# EAGLE design nano (EAGLE 7.2.0)
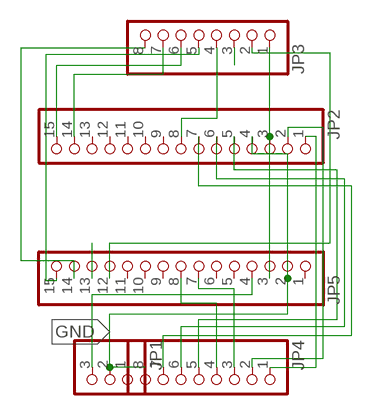
[diagram p0: schematic, sheet 1]

## Parts
JP1  PINHD-1X3CB  [1X03-CLEANBIG]
JP2  PINHD-1X15  [1X15]
JP3  PINHD-1X8CLEANBIG  [1X08-CLEANBIG]
JP4  PINHD-1X8CLEANBIG  [1X08-CLEANBIG]
JP5  PINHD-1X15  [1X15]

## Nets
GND: JP1.2 JP2.4 JP4.8 JP5.2
N$1: JP1.3 JP5.4
N$4: JP4.3 JP5.7
N$6: JP4.4 JP5.8
N$7: JP2.1 JP4.1
N$8: JP2.2 JP4.2
N$9: JP3.5 JP5.15
N$10: JP2.15 JP3.6
N$11: JP2.14 JP3.7
N$12: JP2.5 JP4.5
N$13: JP2.3 JP3.1 JP5.3
N$14: JP3.2 JP5.12
N$15: JP3.3
N$16: JP3.8 JP5.14
N$17: JP5.13
N$18: JP2.6 JP4.6
N$19: JP2.7 JP4.7
N$20: JP2.8 JP3.4
Unconnected: JP1.1 JP2.9 JP2.10 JP2.11 JP2.12 JP2.13 JP5.1 JP5.5 JP5.6 JP5.9 JP5.10 JP5.11

## Library data of the parts
JP1 = adafruit:PINHD-1X3: PIN HEADER
JP2 JP5 = pinhead:PINHD-1X15: PIN HEADER
JP3 JP4 = adafruit:PINHD-1X8: PIN HEADER

## Board
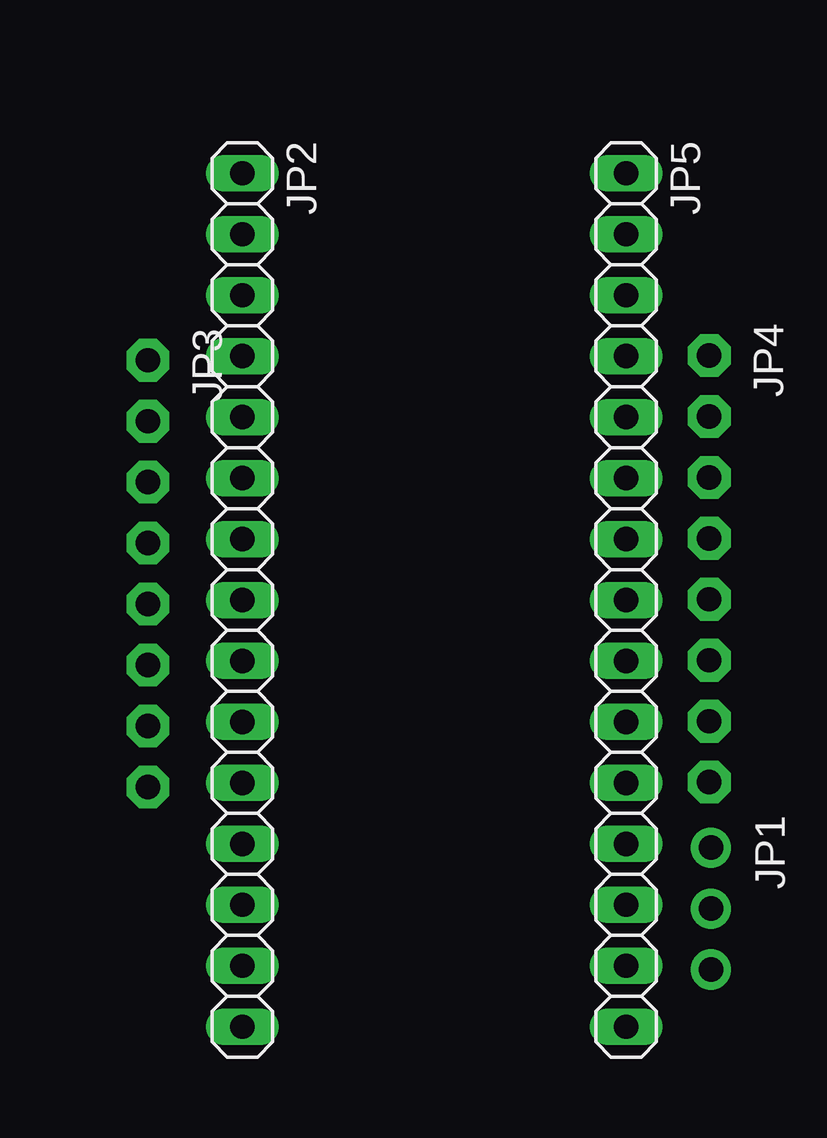
[diagram p1: board, top side]
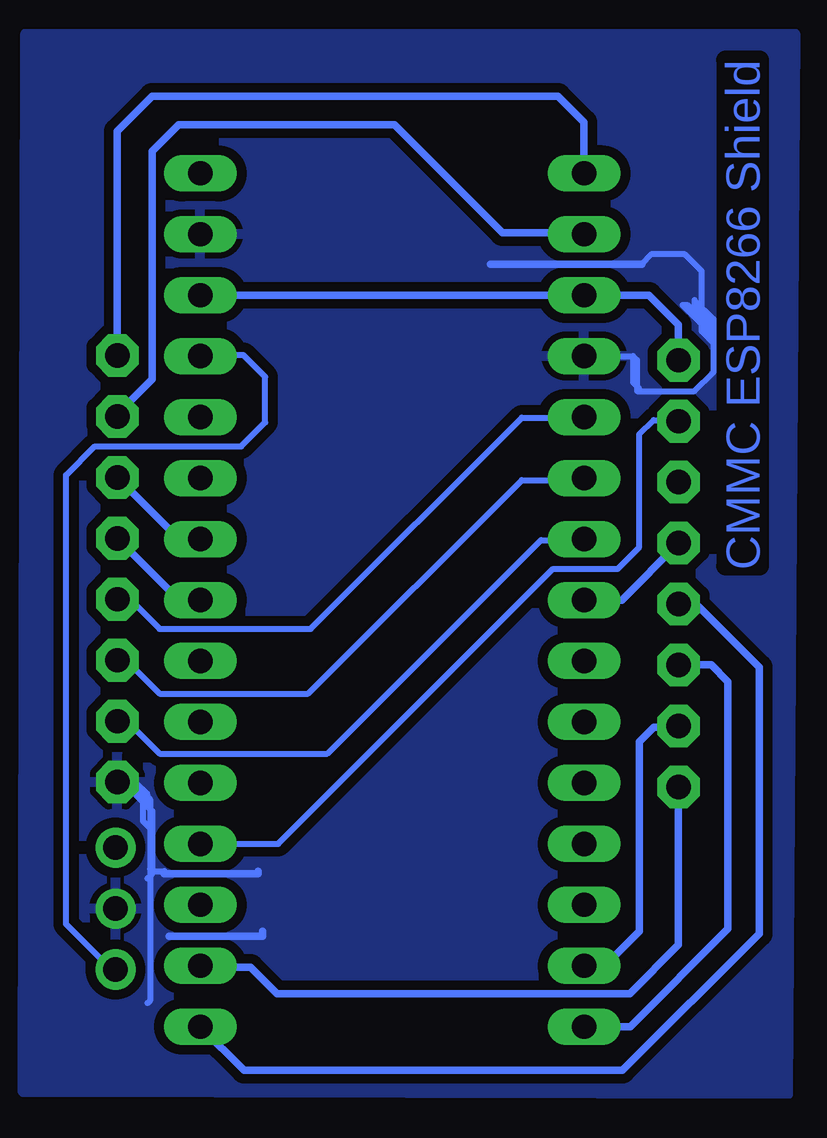
[diagram p2: board, bottom side, seen from below]

No outline drawn. Coordinates in mm, seen from the top.
Copper layers (1*16): Top 0.035mm / dielectric 1.5mm / Bottom 0.035mm
Design rules "default": minimum track width 10mil, minimum drill 24mil, track to track 8mil, track to pad 8mil, pad to pad 8mil, via to via 8mil, smd to smd 8mil, copper to edge 40mil, drill to drill 8mil, minimum pad ring 10mil, minimum via ring 8mil, stop-mask expansion 4mil, vias tented up to drill 0mil, thermal gap 10mil

### Footprints (pad centres in the part's own frame; a part is rotated, then mirrored left to right if it is on the bottom)
1X03-CLEANBIG = drill 1.016 pad 1.676: 1 -2.54,0; 2 0,0; 3 2.54,0
1X15 = drill 1.016 long: 1 -17.78,0; 2 -15.24,0; 3 -12.7,0; 4 -10.16,0; 5 -7.62,0; 6 -5.08,0; 7 -2.54,0; 8 0,0; 9 2.54,0; 10 5.08,0; 11 7.62,0; 12 10.16,0; 13 12.7,0; 14 15.24,0; 15 17.78,0
1X08-CLEANBIG = drill 1.016 pad 1.778 octagon: 1 -8.89,0; 2 -6.35,0; 3 -3.81,0; 4 -1.27,0; 5 1.27,0; 6 3.81,0; 7 6.35,0; 8 8.89,0

### Placement (x,y rotation side)
JP1  28.04,7.74 270 top
JP2  8.5,20.6 270 top
JP3  4.57,21.7 270 top
JP4  27.96,21.9 270 top
JP5  24.5,20.6 270 top

### Tracks (layer width: path | path; a pad name or v marks a point on that pad's centre or on a via)
GND
  Bottom 0.254: 27.71,13.01 26.5,11.8 26.5,9.3 | JP4.8 27.71,13.01 | 26.5,9.3 26.5,9.2 26.6,9.1 | 26.6,9.1 26.7,9 | 27.71,13.01 27.21,13.01 | 27.21,13.01 26.7,12.5 26.9,12.5 | 26.9,12.5 27.1,12.5 27.2,12.6 27.2,12.7 27.3,12.8 | JP2.4 6.46,30.76 | 6.46,30.76 6.3,30.6 6.3,29.3 6.2,29.3 | 27.21,12.91 27.21,12.81 | 27.21,12.81 26.9,12.5 | 26.9,12.5 26.9,11.4 26.6,11.1 26.6,9.1 | 27.21,13.01 27.21,12.91 | 27.21,12.91 26.6,12.3 26.6,12 | 26.6,12 26.6,9.4 | 26.6,9.4 26.5,9.3 | 26.5,9.3 26,9.3 25.9,9.2 22.2,9.2 22.1,9.3 | 27.21,12.81 27.21,12.61 26.6,12 | 26.6,9.4 26.6,3.9 26.7,3.8 | 6.46,30.76 6.46,29.66 6.2,29.4 6.2,29.3 | 6.2,29.3 3.9,29.3 3.1,30.1 3.1,31.3 | 3.1,31.3 3.6,31.8 3.6,32.3 | 3.6,32.3 3.6,34.3 4.3,35 5.7,35 6.1,34.6 | 3.1,31.3 3.1,32.3 3.9,33.1 3.9,32.8 3.2,32.1 3.2,31.8 | 3.2,31.7 3.2,31.8 | 3.2,31.8 3.4,32 | 3.3,31.7 3.5,31.9 3.5,32 | 3.5,32 3.5,32.1 3.4,32.2 | 3.5,32 4.4,32.9 4.2,32.9 3.6,32.3
  Bottom 0.305: 12.4,34.6 6.1,34.6 | 26,9.2 25.9,9.2 22.1,9.2 22.1,9.3 | 25.8,6.6 21.9,6.6 21.9,6.8
  pour Bottom (isolate 0.4): 0,0 31.9,0.1 31.8,44.2 -0.3,44.2
N$1
  Bottom 0.254: JP1.3 28.2,5.2 30.1,7.1 30.1,25.8 28.9,27 22.8,27 21.8,28 21.8,29.9 22.7,30.8 24.46,30.8 JP5.4
N$4
  Bottom 0.305: JP5.7 25.39,23.14 JP4.3
N$6
  Bottom 0.305: JP5.8 25.39,20.6 JP4.4
N$7
  Bottom 0.305: JP4.1 27.96,40.13 26.5,41.6 9.6,41.6 8.5,40.5 JP2.1
N$8
  Bottom 0.305: JP4.2 27.96,28.34 26.5,29.8 26.5,39.3 25.4,40.4 16.4,40.4 11.9,35.9 8.56,35.9 JP2.2
N$9
  Bottom 0.305: JP3.5 3.83,20.43 1.2,17.8 1.2,6.7 6.9,1 22.68,1 JP5.15
N$10
  Bottom 0.305: JP2.15 6.58,2.82 2.5,6.9 2.5,17.2 3.2,17.9 4.55,17.9 JP3.6
N$11
  Bottom 0.305: JP2.14 7.64,5.36 6.2,6.8 6.2,14.7 5.6,15.3 4.62,15.3 JP3.7
N$12
  Bottom 0.254: JP4.5 27.43,20.63 26.2,19.4 19.9,19.4 11.1,28.2 8.52,28.2 JP2.5
N$13
  Bottom 0.305: JP5.3 JP2.3 5.8,33.3 4.57,32.06 JP3.1
N$14
  Bottom 0.254: JP5.12 21.26,10.44 9.8,21.9 7.1,21.9 6.2,22.8 6.2,27.5 5.6,28.1 4.62,28.1 JP3.2
N$16
  Bottom 0.305: JP3.8 4.57,6.24 6.6,4.2 21.3,4.2 22.4,5.3 24.44,5.3 JP5.14
N$18
  Bottom 0.254: JP4.6 27.59,18.09 26.2,16.7 20,16.7 11.1,25.6 8.58,25.6 JP2.6
N$19
  Bottom 0.254: JP4.7 27.55,15.55 26.2,14.2 19.2,14.2 10.3,23.1 8.54,23.1 JP2.7
N$20
  Bottom 0.305: JP2.8 6.93,20.6 JP3.4

### Text on the board
Bottom: CMMC ESP8266 Shield